# Altium schematic sheet FPGA Power.SchDoc
size A
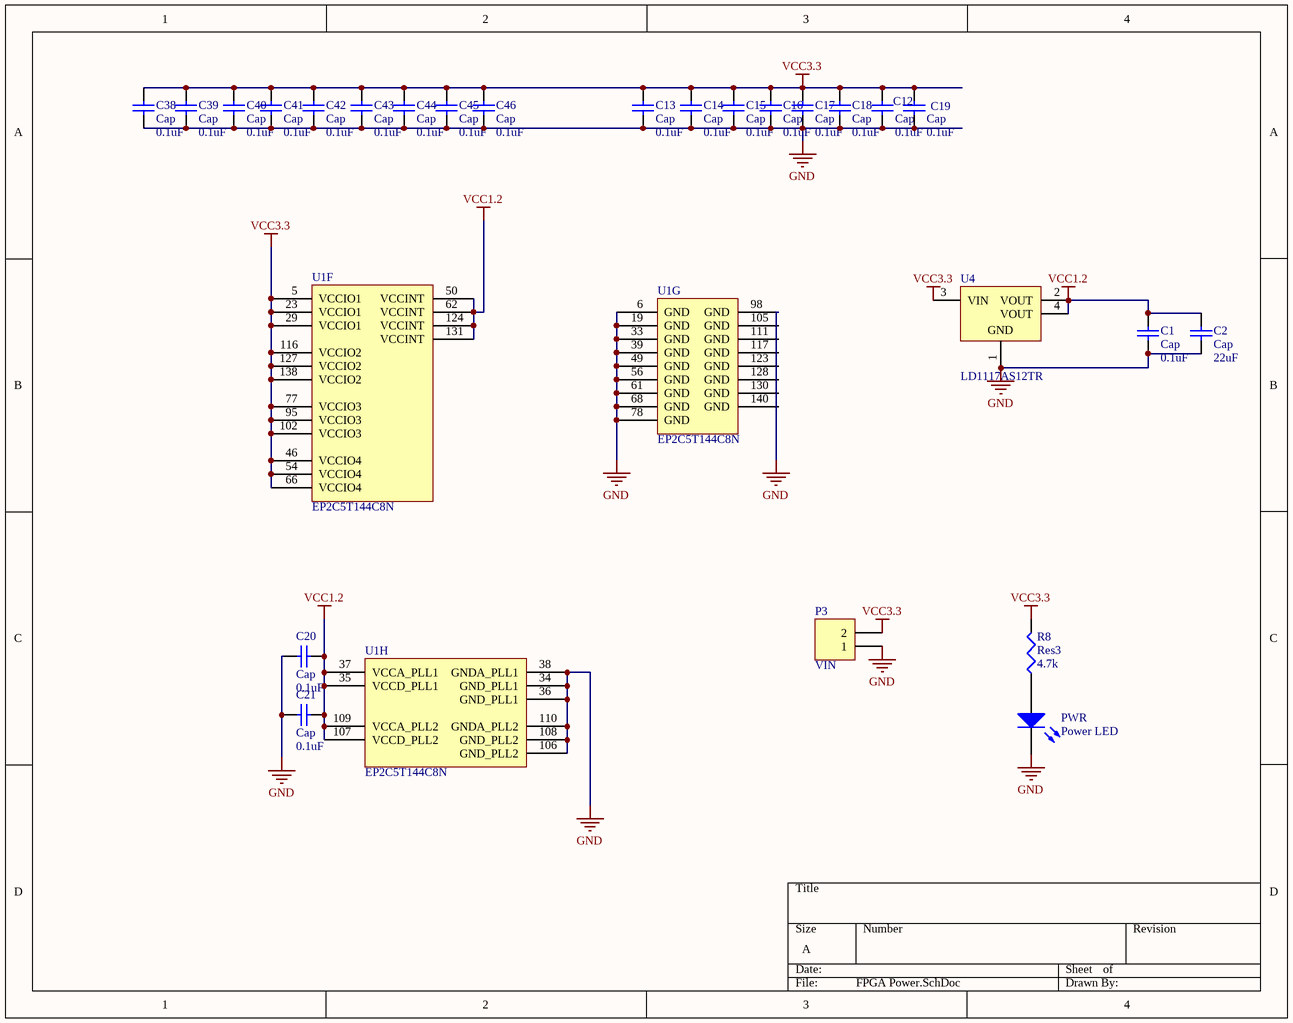
[diagram p0: FPGA Power.SchDoc]

## Parts
C1  Cap  value 0.1uF  [1608[0603]]
C2  Cap  value 22uF  [1608[0603]]
C12  Cap  value 0.1uF  [1608[0603]]
C13  Cap  value 0.1uF  [1608[0603]]
C14  Cap  value 0.1uF  [1608[0603]]
C15  Cap  value 0.1uF  [1608[0603]]
C16  Cap  value 0.1uF  [1608[0603]]
C17  Cap  value 0.1uF  [1608[0603]]
C18  Cap  value 0.1uF  [1608[0603]]
C19  Cap  value 0.1uF  [1608[0603]]
C20  Cap  value 0.1uF  [1608[0603]]
C21  Cap  value 0.1uF  [1608[0603]]
C38  Cap  value 0.1uF  [1608[0603]]
C39  Cap  value 0.1uF  [1608[0603]]
C40  Cap  value 0.1uF  [1608[0603]]
C41  Cap  value 0.1uF  [1608[0603]]
C42  Cap  value 0.1uF  [1608[0603]]
C43  Cap  value 0.1uF  [1608[0603]]
C44  Cap  value 0.1uF  [1608[0603]]
C45  Cap  value 0.1uF  [1608[0603]]
C46  Cap  value 0.1uF  [1608[0603]]
P3  VIN  [HDR1X2]
PWR  Power LED  [1608[0603]]
R8  Res3  value 4.7k  [J1-0603]
U1  EP2C5T144C8N  [TQFP144_N]  (parts F,G,H of 9)
U4  LD1117AS12TR  [SOT223_M]

## Nets
GND: C1.1 C2.1 C12.1 C13.1 C14.1 C15.1 C16.1 C17.1 C18.1 C19.1 C20.1 C21.1 C38.1 C39.1 C40.1 C41.1 C42.1 C43.1 C44.1 C45.1 C46.1 P3.1 PWR.2(K) U1.6(GND) U1.19(GND) U1.33(GND) U1.34(GND_PLL1) U1.36(GND_PLL1) U1.38(GNDA_PLL1) U1.39(GND) U1.49(GND) U1.56(GND) U1.61(GND) U1.68(GND) U1.78(GND) U1.98(GND) U1.106(GND_PLL2) U1.108(GND_PLL2) U1.110(GNDA_PLL2) U4.1(GND)
VCC1.2: C1.2 C2.2 C20.2 C21.2 U1.35(VCCD_PLL1) U1.37(VCCA_PLL1) U1.50(VCCINT) U1.62(VCCINT) U1.107(VCCD_PLL2) U1.109(VCCA_PLL2) U1.124(VCCINT) U1.131(VCCINT) U4.2(VOUT) U4.4(VOUT)
VCC3.3: C12.2 C13.2 C14.2 C15.2 C16.2 C17.2 C18.2 C19.2 C38.2 C39.2 C40.2 C41.2 C42.2 C43.2 C44.2 C45.2 C46.2 P3.2 R8.2 U1.5(VCCIO1) U1.23(VCCIO1) U1.29(VCCIO1) U1.46(VCCIO4) U1.54(VCCIO4) U1.66(VCCIO4) U1.77(VCCIO3) U1.95(VCCIO3) U1.102(VCCIO3) U1.116(VCCIO2) U1.127(VCCIO2) U1.138(VCCIO2) U4.3(VIN)
NetPWR_1: PWR.1(A) R8.1

Not connected (* = marked no-connect by the designer): U1 105(GND) 111(GND) 117(GND) 123(GND) 128(GND) 130(GND) 140(GND)

## Library data of the parts
C1 C2 C12-C21 C38-C46 = Cap Semi: Capacitor (Semiconductor SIM Model); Published: 8-Jun-2000; LatestRevisionDate: 29-May-2009; LatestRevisionNote: IPC-7351 Footprint Added.; PackageReference: C1206; Publisher: Altium Limited; PackageDescription: Chip Capacitor
P3 = Header 2: Header, 2-Pin; LatestRevisionDate: 17-Jul-2002; LatestRevisionNote: Re-released for DXP Platform.; Publisher: Altium Limited
PWR = LED2: Typical RED, GREEN, YELLOW, AMBER GaAs LED; Published: 8-Jun-2000; LatestRevisionDate: 17-Jul-2002; LatestRevisionNote: Re-released for DXP Platform.; PackageVersion: Feb-2002; PackageReference: 3.2X1.6X1.1; Publisher: Altium Limited; PackageDescription: SM LED; 2 Flat Leads
R8 = Res3: Resistor; Published: 8-Jun-2000; LatestRevisionDate: 29-May-2009; LatestRevisionNote: IPC-7351 Footprint Added.; PackageReference: J1-0603; Publisher: Altium Limited; PackageDescription: Chip Resistor
U1 = EP2C5T144C8N: Cyclone II Family, 1.2V FPGA, 89 I/O Pins, 2 PLLs, 144-Pin TQFP, Speed Grade 8, Commercial Grade, Pb-Free; Published: 4-Mar-2005; LatestRevisionDate: 14-May-2007; LatestRevisionNote: DATA0 pin is now INPUT.; DatasheetVersion: ver3.3, Feb-2008; PackageVersion: ver15.4, Dec-2008; PackageReference: TQFP144; Publisher: Altium Limited; PackageDescription: 144-Pin Plastic Thin Quad Flat Pack (TQFP144) - Wire Bond; Supplier 1: Digi-Key; Supplier Part Number 1: 544-1665-ND; Supplier 2: Farnell; Supplier Part Number 2: 1662263; Supplier 3: Farnell; Supplier Part Number 3: 1453497; Code_JEDEC: MS-026-BFB; ComponentLink1Description: Manufacturer Link; ComponentLink1URL: http://www.altera.com/products/devices/cyclone2/cy2-index.jsp; ComponentLink2Description: Handbook; ComponentLink2URL: http://www.altera.com/literature/hb/cyc2/cyc2_cii5v1.pdf; ComponentLink3Description: Packaging Specification; ComponentLink3URL: http://www.altera.com/literature/ds/dspkg.pdf
U4 = LD1117AS12TR: 1A, Low Drop Positive Voltage Regulator, 1.2V, 4-Pin SOT-223, Tape and Reel; DatasheetVersion: Dec-2011; PackageVersion: 2010; PackageReference: SOT-223; PackageDescription: 4-Pin SOT-223 Package, 6.5 x 3.5 mm Body, 2.3 mm Pitch, 7 mm Lead Span; PartNumber: LD1117AS12TR; ComponentLink1Description: Manufacturer URL; ComponentLink1URL: http://www.st.com; ComponentLink2Description: Datasheet; ComponentLink2URL: http://www.st.com/internet/com/TECHNICAL_RESOURCES/TECHNICAL_LITERATURE/DATASHEET/CD00002116.pdf